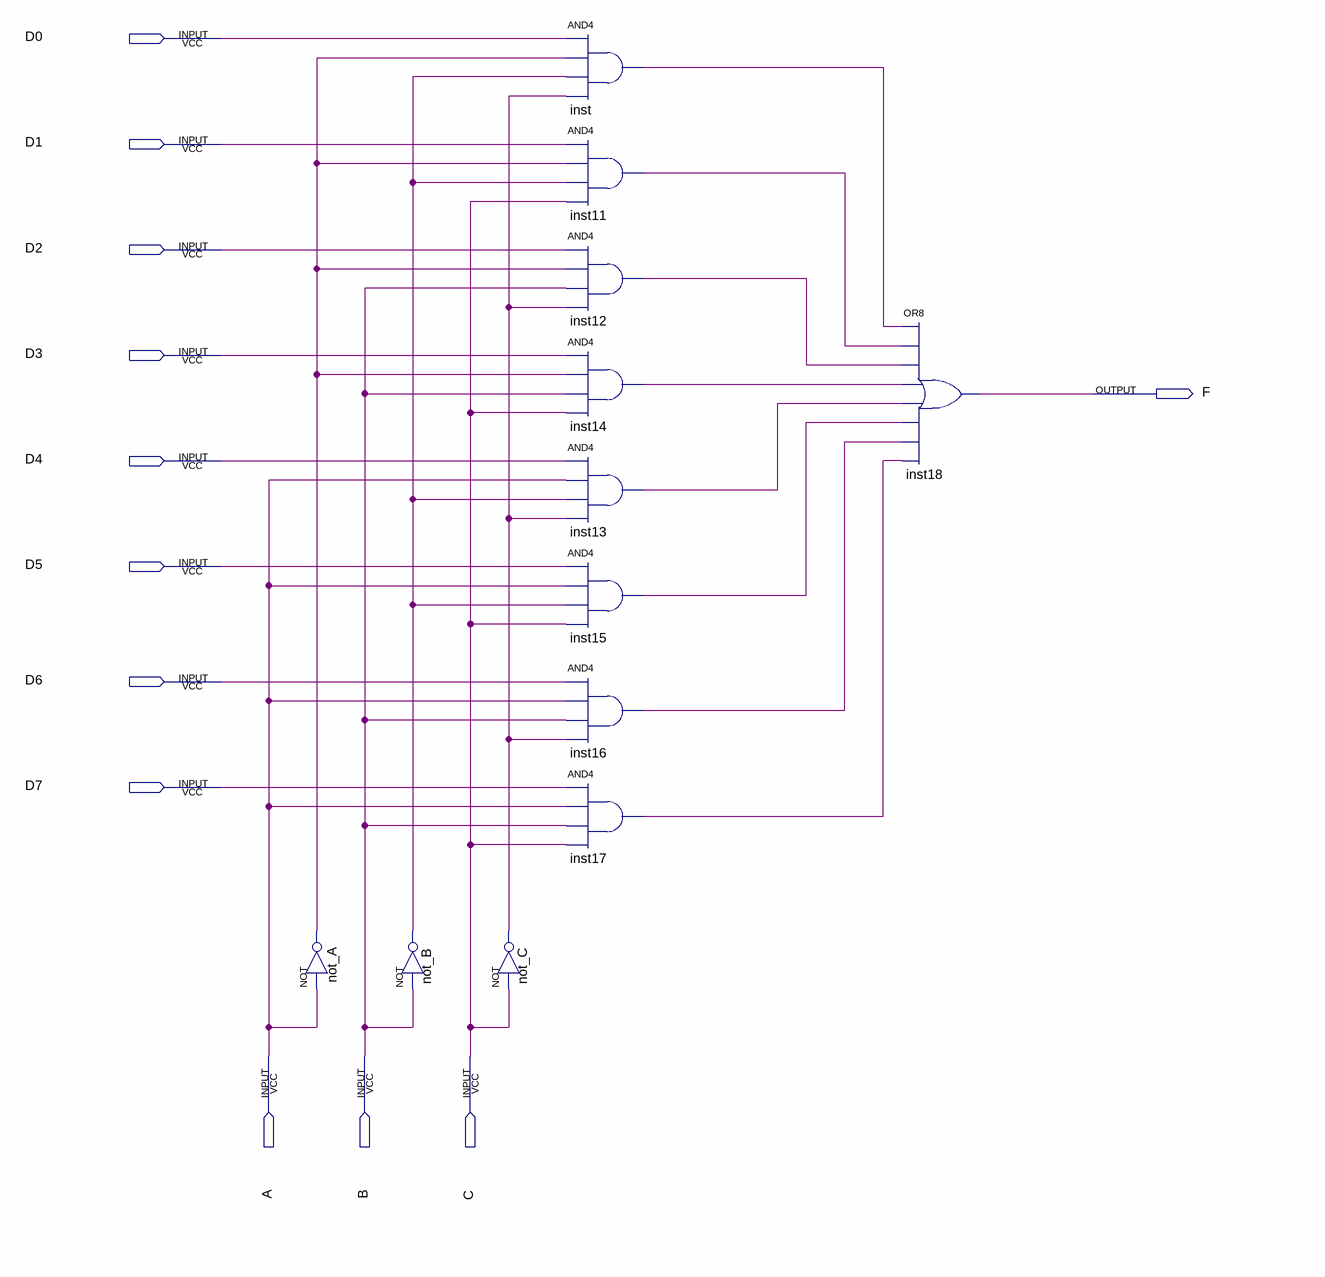
[diagram p0: schematic sheet]
// Quartus schematic Block1.bdf as structural Verilog: 12 symbols, 12 pins
module Block1 (
  input  D0,
  input  D1,
  input  D2,
  input  D3,
  input  D4,
  input  D5,
  input  D6,
  input  D7,
  input  A,
  input  B,
  input  C,
  output F
);

  wire inst11_out, inst12_out, inst13_out, inst14_out, inst15_out, inst16_out, inst17_out, inst_out,
       not_A_out, not_B_out, not_C_out;

  not not_A (not_A_out, A);
  not not_B (not_B_out, B);
  not not_C (not_C_out, C);
  and inst (inst_out, D0, not_A_out, not_B_out, not_C_out);
  and inst11 (inst11_out, D1, not_A_out, not_B_out, C);
  and inst12 (inst12_out, D2, not_A_out, B, not_C_out);
  and inst14 (inst14_out, D3, not_A_out, B, C);
  and inst13 (inst13_out, D4, A, not_B_out, not_C_out);
  and inst15 (inst15_out, D5, A, not_B_out, C);
  and inst16 (inst16_out, D6, A, B, not_C_out);
  and inst17 (inst17_out, D7, A, B, C);
  or inst18 (F, inst_out, inst11_out, inst12_out, inst14_out, inst13_out, inst15_out, inst16_out, inst17_out);
endmodule
